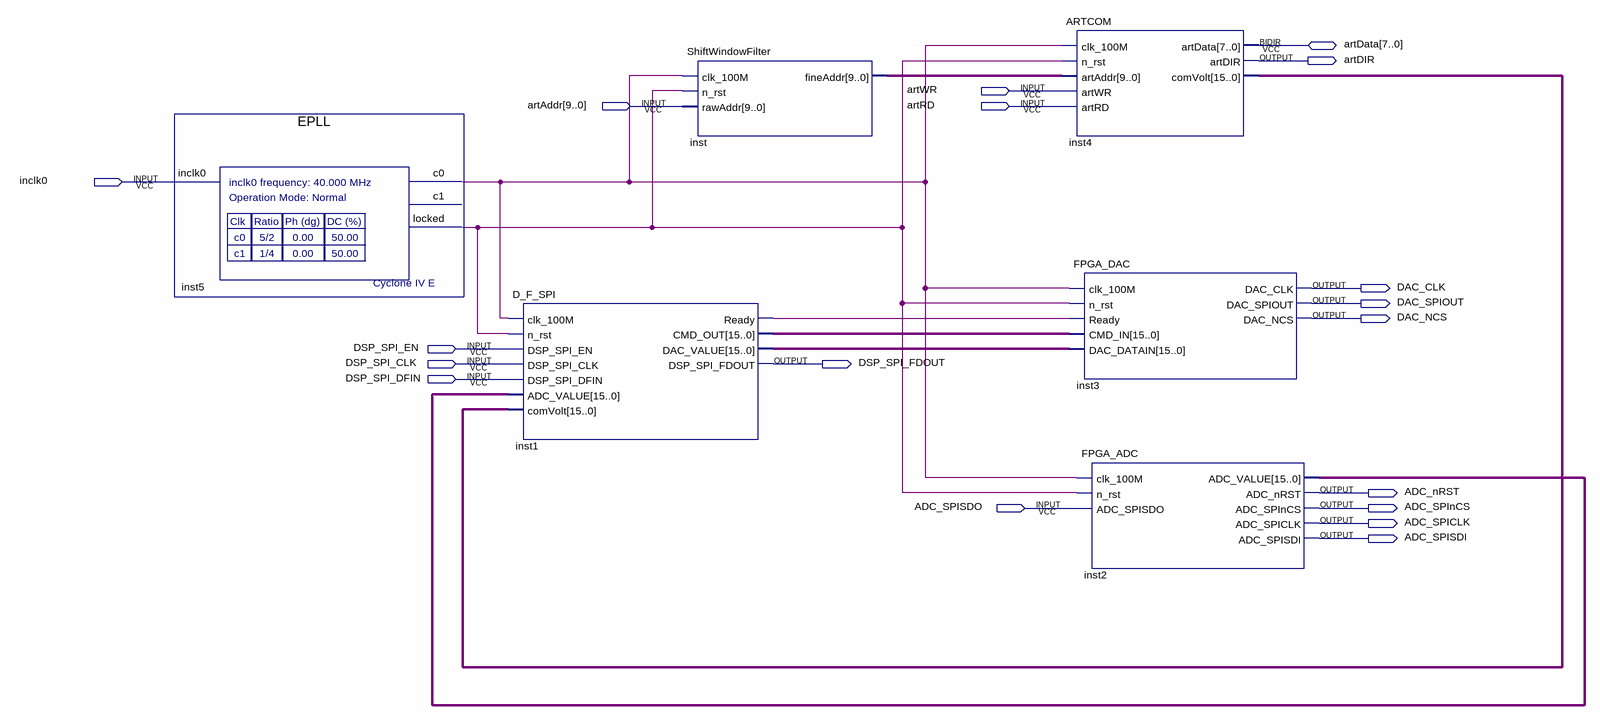
[diagram p0: schematic sheet]
// Quartus schematic JK02FPGA.bdf as structural Verilog: 6 symbols, 18 pins
module JK02FPGA (
  input  artWR,
  input  [9:0] artAddr,
  input  artRD,
  input  inclk0,
  input  DSP_SPI_EN,
  input  DSP_SPI_CLK,
  input  DSP_SPI_DFIN,
  input  ADC_SPISDO,
  inout  [7:0] artData,
  output artDIR,
  output DAC_CLK,
  output DAC_SPIOUT,
  output DAC_NCS,
  output DSP_SPI_FDOUT,
  output ADC_nRST,
  output ADC_SPInCS,
  output ADC_SPICLK,
  output ADC_SPISDI
);

  wire inst1_ready, inst5_c0, inst5_locked;
  wire [9:0] inst_fineaddr;
  wire [15:0] inst1_cmd_out, inst1_dac_value, inst2_adc_value, inst4_comvolt;

  EPLL inst5 (.inclk0(inclk0), .c0(inst5_c0), .locked(inst5_locked));  // open: c1
  D_F_SPI inst1 (
    .clk_100M(inst5_c0), .n_rst(inst5_locked), .DSP_SPI_EN(DSP_SPI_EN), .DSP_SPI_CLK(DSP_SPI_CLK),
    .DSP_SPI_DFIN(DSP_SPI_DFIN), .ADC_VALUE(inst2_adc_value), .comVolt(inst4_comvolt), .Ready(inst1_ready),
    .CMD_OUT(inst1_cmd_out), .DAC_VALUE(inst1_dac_value), .DSP_SPI_FDOUT(DSP_SPI_FDOUT));
  ShiftWindowFilter inst (.clk_100M(inst5_c0), .n_rst(inst5_locked), .rawAddr(artAddr), .fineAddr(inst_fineaddr));
  ARTCOM inst4 (
    .clk_100M(inst5_c0), .n_rst(inst5_locked), .artAddr(inst_fineaddr), .artWR(artWR), .artRD(artRD),
    .artDIR(artDIR), .comVolt(inst4_comvolt), .artData(artData));
  FPGA_DAC inst3 (
    .clk_100M(inst5_c0), .n_rst(inst5_locked), .Ready(inst1_ready), .CMD_IN(inst1_cmd_out),
    .DAC_DATAIN(inst1_dac_value), .DAC_CLK(DAC_CLK), .DAC_SPIOUT(DAC_SPIOUT), .DAC_NCS(DAC_NCS));
  FPGA_ADC inst2 (
    .clk_100M(inst5_c0), .n_rst(inst5_locked), .ADC_SPISDO(ADC_SPISDO), .ADC_VALUE(inst2_adc_value),
    .ADC_nRST(ADC_nRST), .ADC_SPInCS(ADC_SPInCS), .ADC_SPICLK(ADC_SPICLK), .ADC_SPISDI(ADC_SPISDI));
endmodule
